# Altium schematic sheet P03_UART_Debug.SchDoc
size A4
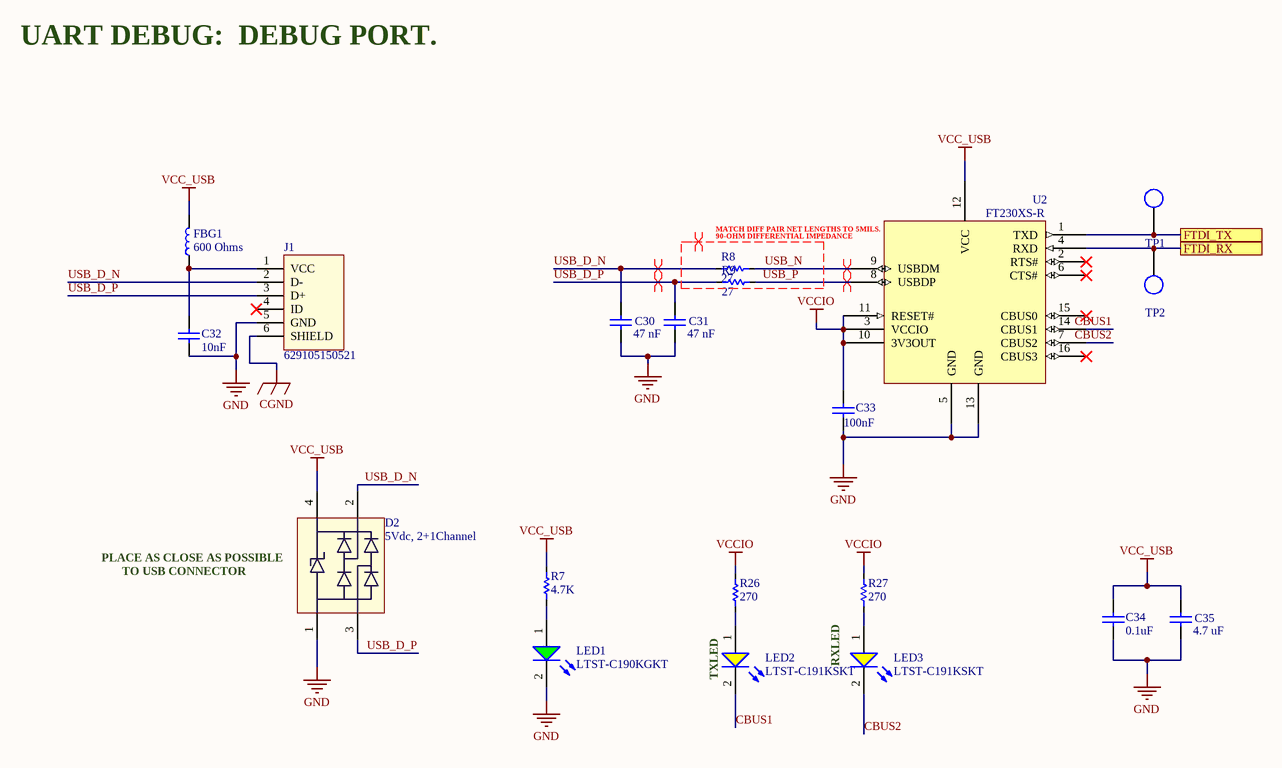
[diagram p0: P03_UART_Debug.SchDoc]

## Parts
C30  47 nF  [CAP_0603]
C31  47 nF  [CAP_0603]
C32  10nF  [CAP_0603]
C33  100nF  [CAP_0603]
C34  0.1uF  [CAP_0603]
C35  4.7 uF  [CAP_0603]
D2  5Vdc, 2+1Channel  [SOT143-4L]
FBG1  600 Ohms  [CAP_0603]
J1  629105150521  [629105150521]
LED1  LTST-C190KGKT  [LED_0603]
LED2  LTST-C191KSKT  [LED_0603]
LED3  LTST-C191KSKT  [LED_0603]
R7  4.7K  [RES_0603]
R8  27  [RES_0603]
R9  27  [RES_0603]
R26  270  [RES_0603]
R27  270  [RES_0603]
TP1  TP_SMD  [TP_SMD]  (value not drawn)
TP2  TP_SMD  [TP_SMD]  (value not drawn)
U2  FT230XS-R  [SOP64P600X175-16N]

## Ports
FTDI_RX, FTDI_TX

## Nets
CGND: J1.6(SHIELD)
GND: C30.2(P) C31.2(P) C32.1 C33.1 C34.1 C35.1(N) D2.1(GND) J1.5(GND) LED1.2(C) U2.5(GND) U2.13(GND)
VCC_USB: C34.2 C35.2(P) D2.4(VDD) FBG1.2 R7.2 U2.12(VCC)
VCCIO: C33.2 R26.2 R27.2 U2.3(VCCIO) U2.10(3V3OUT) U2.11(RESET#)
CBUS1: LED2.2(C) U2.14(CBUS1)
CBUS2: LED3.2(C) U2.7(CBUS2)
FTDI_RX: TP2.1 U2.4(RXD) ; port FTDI_RX
FTDI_TX: TP1.1 U2.1(TXD) ; port FTDI_TX
USB_D_N: C30.1(N) D2.2(IO1) J1.2(D-) R8.1
USB_D_P: C31.1(N) D2.3(IO2) J1.3(D+) R9.1
USB_N: R8.2 U2.9(USBDM)
USB_P: R9.2 U2.8(USBDP)
NetC32_2: C32.2 FBG1.1 J1.1(VCC)
NetLED1_1: LED1.1(A) R7.1
NetLED2_1: LED2.1(A) R26.1
NetLED3_1: LED3.1(A) R27.1

Not connected (* = marked no-connect by the designer): J1 4(ID)*; U2 2(RTS#)* 6(CTS#)* 15(CBUS0)* 16(CBUS3)*

## Layout directives
differential pair; differential pair class USB; rule Matched Net Lengths [Tolerance = 5mil]: USB_D_N, USB_N
differential pair; net class Z90_DIFF: USB_N, USB_P
differential pair; differential pair class USB: USB_D_P, USB_P

## Notes on the sheet
- UART DEBUG:  DEBUG PORT.
- MATCH DIFF PAIR NET LENGTHS TO 5MILS.
- 90-OHM DIFFERENTIAL IMPEDANCE
- PLACE AS CLOSE AS POSSIBLE
- TO USB CONNECTOR
- (near LED2) TXLED
- (near LED3) RXLED

## Library data of the parts
C30 C31 = C0603C473K4RACTU: CAP CER 0.047UF 16V X7R 0603; Manufacturer: KEMET; Tolerance: 10%; Rated Voltage: 16 VDC; ComponentLink1Description: Manufacturer; ComponentLink1URL: http://www.we-online.de; ComponentLink2Description: Datasheet; ComponentLink2URL: https://katalog.we-online.com/pbs/datasheet/865080345012.pdf; Mounting Technology: SMD; Value: 47 nF; Manufacturer Part No.: C0603C473K4RACTU; Datasheet: https://api.kemet.com/component-edge/download/datasheet/C0603C473K4RACTU.pdf; Supplier: Digi-Key; Package Reference: CAP_0603; Supplier Part No.: 399-7932-2-ND; Package Description: 0603
C32 = C0603C104M4RACTU: CAP CER 10000PF 16V NPO 0805; Manufacturer: Yageo; Manufacturer Part No.: CC0805JKNPO7BN103; Ceramic Type: NP0; Tolerance: 5%; ComponentLink1Description: Manufacturer; ComponentLink1URL: http://www.we-online.de; Value: 10nF; Rated Voltage: 16V; Supplier Part No.: 311-4205-1-ND; Package Reference: CAP_0805; Package Description: 0805; Mounting Technology: SMD; Datasheet: https://www.yageo.com/upload/media/product/productsearch/datasheet/mlcc/UPY-GP_NP0_16V-to-50V_18.pdf; Supplier: Digi-Key; ComponentLink2Description: Datasheet; ComponentLink2URL: https://content.kemet.com/datasheets/KEM_C1002_X7R_SMD.pdf
C33 = C0603C104M4RACTU: CAP CER 100PF 16V NP0 0603; Manufacturer: KEMET; Manufacturer Part No.: C0603C101J4GAC7867; Ceramic Type: X7R; Tolerance: 5%; ComponentLink1Description: Manufacturer; ComponentLink1URL: http://www.we-online.de; Value: 100nF; Rated Voltage: 16V; Supplier Part No.: 399-14476-1-ND; Package Reference: CAP_0603; Package Description: 0603; Mounting Technology: SMD; Datasheet: https://api.kemet.com/component-edge/download/datasheet/C0603C101J4GACTU.pdf; Supplier: Digi-Key; ComponentLink2Description: Datasheet; ComponentLink2URL: https://content.kemet.com/datasheets/KEM_C1002_X7R_SMD.pdf
C34 = C0603C104K4PAC7867: CAP CER 0.1UF 16V X5R 0603; Manufacturer: KEMET; Tolerance: 5%; ComponentLink1Description: Manufacturer; ComponentLink1URL: http://www.we-online.de; Value: 0.1uF; Rated Voltage: 16V; Ceramic Type: X5R; Supplier Part No.: 399-14941-1-ND; Package Reference: CAP_0603; Package Description: 0603; Mounting Technology: SMD; Manufacturer Part No.: C0603C104K4PAC7867; Datasheet: https://api.kemet.com/component-edge/download/datasheet/C0603C104K4PAC7867.pdf; Supplier: Digi-Key; ComponentLink2Description: Datasheet; ComponentLink2URL: https://content.kemet.com/datasheets/KEM_C1002_X7R_SMD.pdf
C35 = C0603C473K4RACTU_1: CAP CER 4.7UF 16V X5R 0603; Manufacturer Part No.: GRM188R61C475KAAJD; Manufacturer: Murata Electronics; Tolerance: 10%; Rated Voltage: 16 VDC; ComponentLink1Description: Manufacturer; ComponentLink1URL: http://www.we-online.de; ComponentLink2Description: Datasheet; ComponentLink2URL: https://katalog.we-online.com/pbs/datasheet/865080345012.pdf; Mounting Technology: SMD; Value: 4.7 uF; Datasheet: https://search.murata.co.jp/Ceramy/image/img/A01X/G101/ENG/GRM188R61C475KAAJ-01.pdf; Supplier: Digi-Key; Package Reference: CAP_0603; Supplier Part No.: 490-10481-1-ND; Package Description: 0603
D2 = 8240026: TVS DIODE 5V 9V SOT143-4 ESD; Manufacturer: Wurth Elektronik; Reverse Breakdown Voltage min.: 6V; Channel: 2+1; Channel Input Capacitance: 1.2pF; Reverse Peak Pulse Current: 6A; Reverse Channel Leakage Current: 1uA; ComponentLink1Description: Manufacturer; ComponentLink1URL: http://www.we-online.de; ComponentLink2Description: Datasheet; ComponentLink2URL: https://katalog.we-online.com/pbs/datasheet/8240026.pdf; Mounting Technology: SMD; DC Operating Voltage: 5V; Supplier: Digi-Key; Manufacturer Part No.: 8240026; Supplier Part No.: 732-4470-1-ND; Datasheet: https://www.we-online.de/katalog/datasheet/8240026.pdf; Package Description: SOT143-4
FBG1 = Ferrite Bead Generic: 600 Ohms @ 100MHz Ferrite Bead 0603 2A 100mOhm; Manufacturer: Chilisin Electronics; Manufacturer Part No.: BBHV00160808601Y00; ComponentLink1Description: Manufacturer; ComponentLink1URL: http://www.we-online.de; Value: 600 Ohms; Supplier Part No.: 2184-BBHV00160808601Y00CT-ND; Package Reference: FB_0603; Package Description: 0603; Mounting Technology: SMD; Datasheet: https://www.chilisin.com/upload/media/product/emi_bead/file/BBHV_Series.pdf; Tolerance: -; Supplier: Digi-Key; ComponentLink2Description: Datasheet; ComponentLink2URL: https://content.kemet.com/datasheets/KEM_C1002_X7R_SMD.pdf; Rated Current: 2 A
J1 = 629105150521: CONN RCPT USB2.0 MICRO B SMD R/A; Manufacturer: Wurth Elektronik; ComponentLink1 Description: Manufacturer; ComponentLink2 Description: Datasheet; ComponentLink1URL: http://www.we-online.de; ComponentLink2URL: http://katalog.we-online.de/em/datasheet/629105150521.pdf; Supplier: Digi-Key; Mounting Technology: THRU/SMD; Supplier Part No.: 732-5960-1-ND; Package Description: MICRO USB TYPE B DEVICE RECEPTACLE; Manufacturer Part No.: 629105150521; Package Reference: 629105150521; Datasheet: https://www.we-online.de/katalog/datasheet/629105150521.pdf
LED1 = LTST-C190KGKT: LED GREEN CLEAR CHIP SMD 0603; Manufacturer: Lite-On Inc.; Vf: 2V; Test Current: 20 mA; ComponentLink1Description: Manufacturer; ComponentLink1URL: http://www.we-online.de; ComponentLink2Description: Datasheet; ComponentLink2URL: http://katalog.we-online.com/led/datasheet/150080BS75000.pdf; Color: Green; Manufacturer Part No.: LTST-C190KGKT; Supplier: Digi-Key; Package Reference: LED_0603; Supplier Part No.: 160-1435-1-ND; Mounting Technology: SMD; Datasheet: http://optoelectronics.liteon.com/upload/download/DS22-2000-074/LTST-C190KGKT.PDF
LED2 LED3 = LTST-C191KSKT: LED YELLOW CLEAR SMD 0603; Manufacturer: Lite-On Inc.; Vf: 2.1V; Test Current: 20 mA; ComponentLink1Description: Manufacturer; ComponentLink1URL: http://www.we-online.de; ComponentLink2Description: Datasheet; ComponentLink2URL: http://katalog.we-online.com/led/datasheet/150080BS75000.pdf; Color: Yellow; Manufacturer Part No.: LTST-C191KSKT; Supplier: Digi-Key; Package Reference: LED_0603; Supplier Part No.: 160-1448-1-ND; Mounting Technology: SMD; Datasheet: http://optoelectronics.liteon.com/upload/download/DS22-2000-224/LTST-C191KSKT.PDF
R7 = RC0603JR-074K7L: RES SMD 4.7K OHM 5% 1/10W 0603; Manufacturer: Yageo; Value: 4.7K; Tolerance: 5%; Manufacturer Part No.: RC0603JR-074K7L; Date: 2020; ComponentLink1Description: Manufacturer Link; ComponentLink1URL: http://www.vishay.com/company/brands/dale/; ComponentLink2Description: Datasheet; ComponentLink2URL: http://www.vishay.com/docs/20035/dcrcwe3.pdf; Supplier: Digikey; Supplier Part No.: 311-4.7KGRCT-ND; Datasheet: https://www.yageo.com/upload/media/product/productsearch/datasheet/rchip/PYu-RC_Group_51_RoHS_L_10.pdf; Package Reference: RES_0603; Package Description: 0603; Mounting Technology: SMD; Power Rating: 1/10W
R8 R9 = RC0603JR-0727RL: RES SMD 27 OHM 5% 1/10W 0603; Manufacturer: Yageo; Value: 27; Tolerance: 5%; Manufacturer Part No.: RC0603JR-0727RL; Date: 2020; ComponentLink1Description: Manufacturer Link; ComponentLink1URL: http://www.vishay.com/company/brands/dale/; ComponentLink2Description: Datasheet; ComponentLink2URL: http://www.vishay.com/docs/20035/dcrcwe3.pdf; Supplier: Digikey; Supplier Part No.: 311-27GRCT-ND; Datasheet: https://www.yageo.com/upload/media/product/productsearch/datasheet/rchip/PYu-RC_Group_51_RoHS_L_10.pdf; Package Reference: RES_0603; Package Description: 0603; Mounting Technology: SMD
R26 R27 = RC0603JR-07270RL: RES SMD 270 OHM 5% 1/10W 0603; Manufacturer: Yageo; Tolerance: 5%; Manufacturer Part No.: RC0603JR-07270RL; Date: 2020; ComponentLink1Description: Manufacturer Link; ComponentLink1URL: http://www.vishay.com/company/brands/dale/; ComponentLink2Description: Datasheet; ComponentLink2URL: http://www.vishay.com/docs/20035/dcrcwe3.pdf; Supplier: Digikey; Supplier Part No.: 311-270GRCT-ND; Datasheet: https://www.yageo.com/upload/media/product/productsearch/datasheet/rchip/PYu-RC_Group_51_RoHS_L_10.pdf; Package Reference: RES_0603; Package Description: 0603; Mounting Technology: SMD; Power Rating: 1/10W; Value: 270
U2 = FT230XS-R: IC USB SERIAL BASIC UART 16SSOP; Manufacturer: FTDI, Future Technology Devices International Ltd; Manufacturer Part No.: FT230XS-R; Supplier: Digi-Key; Mounting Technology: SMD; Supplier Part No.: 768-1135-1-ND; Datasheet: https://www.ftdichip.com/Support/Documents/DataSheets/ICs/DS_FT230X.pdf; Package Reference: SSOP-16; Package Description: USB Bridge, USB to UART USB 2.0 UART Interface 16-SSOP; ComponentLink1Description: Datasheet; ComponentLink1URL: https://www.ftdichip.com/Support/Documents/DataSheets/ICs/DS_FT230X.pdf